# Altium schematic sheet currentmode_buck.SCHDOC: Current Mode DC-DC Converter
size A4; Address1: mkissin@gmail.com; Revision: 4.0; SheetNumber: 1; SheetTotal: 1
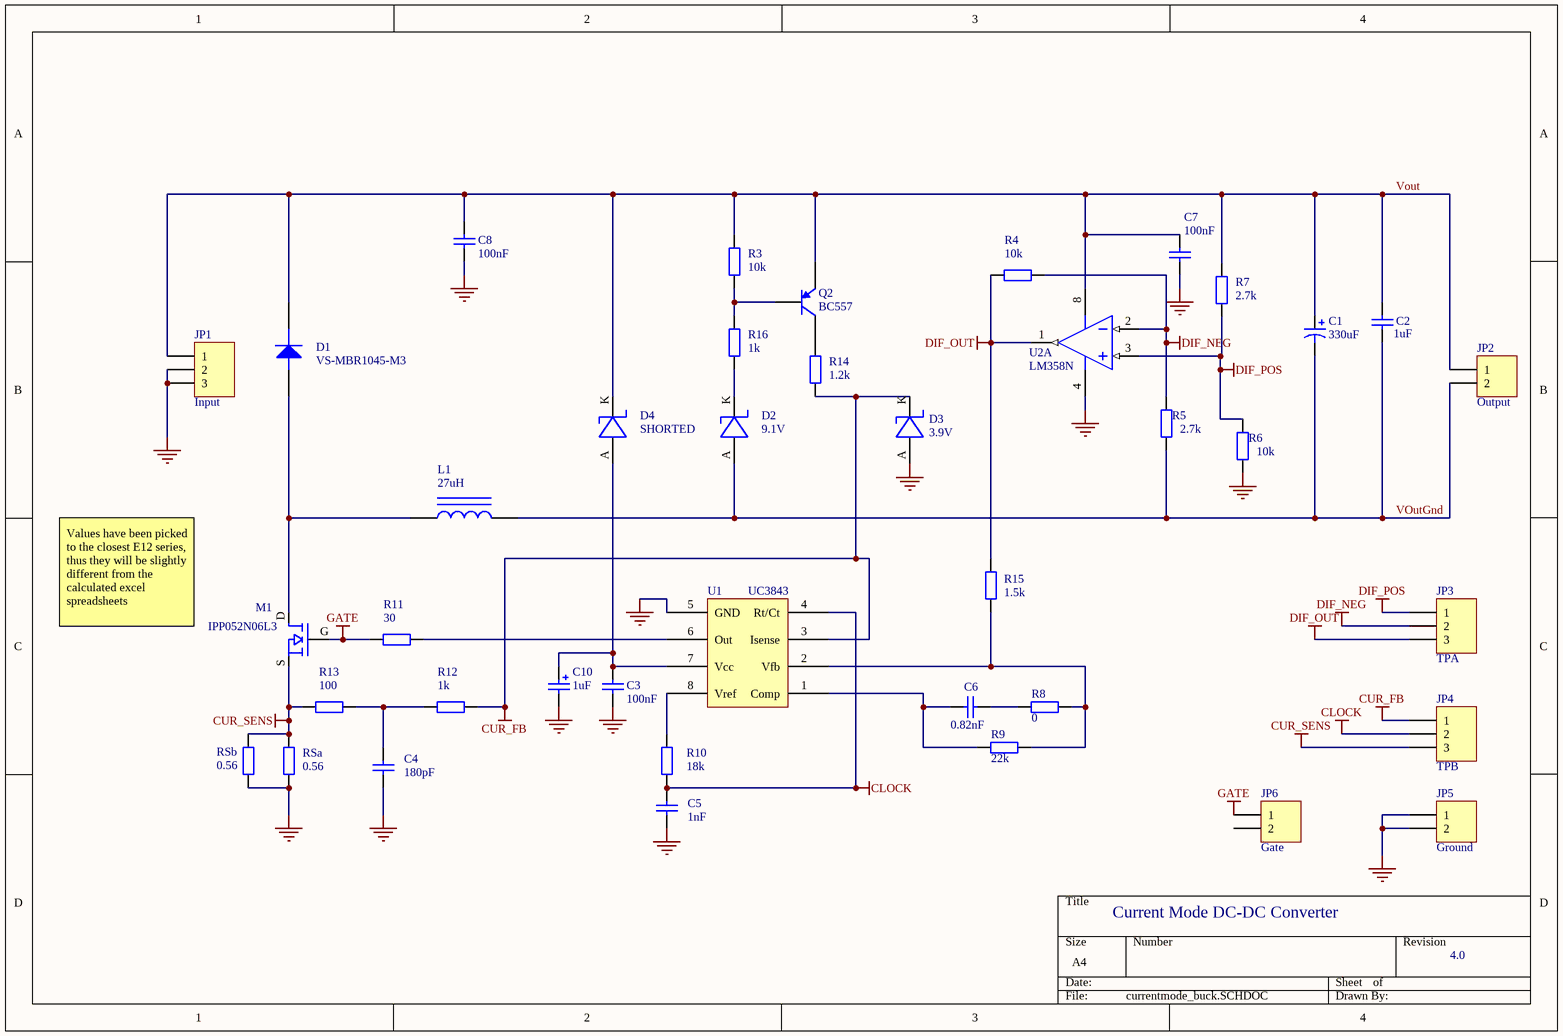
[diagram p0: currentmode_buck.SCHDOC]

## Parts
C1  value 330uF  [cappr5-5x5]  (hidden comment: Cap Pol2)
C2  value 1uF  [CAPR5.08-7.8X3.2]  (hidden comment: 120pF)
C3  value 100nF  [CAPR5.08-7.8X3.2]  (hidden comment: Cap)
C4  value 180pF  [CAPR5.08-7.8X3.2]  (hidden comment: Cap)
C5  value 1nF  [CAPR5.08-7.8X3.2]  (hidden comment: Cap)
C6  value 0.82nF  [CAPR5.08-7.8X3.2]  (hidden comment: Cap)
C7  value 100nF  [CAPR5.08-7.8X3.2]  (hidden comment: Cap)
C8  value 100nF  [CAPR5.08-7.8X3.2]  (hidden comment: Cap)
C10  value 1uF  [CAPPR1.5-4X5]  (hidden comment: Cap Pol1)
D1  VS-MBR1045-M3  [TO220_DIODE_COMB]
D2  9.1V  [DIODE0.4]
D3  3.9V  [DIODE0.4]
D4  SHORTED  [DIODE0.4]
JP1  Input  [CON3_FEM]
JP2  Output  [WIDEHEADER2]
JP3  TPA  [HDR1X3]
JP4  TPB  [HDR1X3]
JP5  Ground  [HDR1X2]
JP6  Gate  [HDR1X1]
L1  value 27uH  [efd20]  (hidden comment: Inductor Iron)
M1  IPP052N06L3  [SOT_78_H]
Q2  BC557  [29-04]
R3  10k  [AXIAL-0.4]
R4  value 10k  [AXIAL-0.4]  (hidden comment: Res2)
R5  value 2.7k  [AXIAL-0.4]  (hidden comment: Res2)
R6  value 10k  [AXIAL-0.4]  (hidden comment: Res2)
R7  value 2.7k  [AXIAL-0.4]  (hidden comment: Res2)
R8  value 0  [AXIAL-0.4]  (hidden comment: Res2)
R9  value 22k  [AXIAL-0.4]  (hidden comment: Res2)
R10  value 18k  [AXIAL-0.4]  (hidden comment: Res2)
R11  value 30  [AXIAL-0.4]  (hidden comment: Res2)
R12  value 1k  [AXIAL-0.4]  (hidden comment: Res2)
R13  value 100  [AXIAL-0.4]  (hidden comment: Res2)
R14  value 1.2k  [AXIAL-0.4]  (hidden comment: Res2)
R15  value 1.5k  [AXIAL-0.4]  (hidden comment: Res2)
R16  value 1k  [AXIAL-0.4]  (hidden comment: Res2)
RSa  value 0.56  [AXIAL-0.4]  (hidden comment: Res2)
RSb  value 0.56  [AXIAL-0.4]  (hidden comment: Res2)
U1  UC3843  [dip8]
U2  LM358N  [dip8]  (part A of 2)

## Nets
CLOCK: C5.2 JP4.2 R10.1 U1.4(Rt/Ct)
CUR_FB: D3.K JP4.1 R12.2 R14.1 U1.3(Isense)
CUR_SENS: JP4.3 M1.S R13.1 RSa.2 RSb.2
DIF_NEG: JP3.2 R4.1 R5.2 U2.2(IN-)
DIF_OUT: JP3.3 R4.2 R15.1 U2.1(OUT)
DIF_POS: JP3.1 R6.2 R7.1 U2.3(IN+)
GATE: JP6.1 M1.G R11.2
GND: C3.1 C4.1 C5.1 C7.1 C8.1 C10.2 D3.A JP1.2 JP1.3 JP5.1 JP5.2 R6.1 RSa.1 RSb.1 U1.5(GND) U2.4(V-)
Vout: C1.1 C2.2 C7.2 C8.2 D1.K D4.K JP1.1 JP2.1 Q2.3(E) R3.2 R7.2 U2.8(V+)
VOutGnd: C1.2 C2.1 D2.A JP2.2 L1.2 R5.1
NetC3_2: C3.2 C10.1 D4.A U1.7(Vcc)
NetC4_2: C4.2 R12.1 R13.2
NetC6_1: C6.1 R8.2
NetC6_2: C6.2 R9.2 U1.1(Comp)
NetD1_A: D1.A L1.4 M1.D
NetD2_K: D2.K R16.1
NetQ2_1: Q2.1(C) R14.2
NetQ2_2: Q2.2(B) R3.1 R16.2
NetR8_1: R8.1 R9.1 R15.2 U1.2(Vfb)
NetR10_2: R10.2 U1.8(Vref)
NetR11_1: R11.1 U1.6(Out)

Not connected (* = marked no-connect by the designer): JP6 2

## Notes on the sheet
- Values have been picked to the closest E12 series, thus they will be slightly different from the calculated excel spreadsheets

## Library data of the parts
C1 = Cap Pol2: Polarized Capacitor (Axial); Published: 8-Jun-2000; Revision: July-2002: Re-released for DXP Platform.; Publisher: Altium Limited
C2-C8 = Cap: Capacitor; Published: 8-Jun-2000; Revision: July-2002: Re-released for DXP Platform.; Publisher: Altium Limited
C10 = Cap Pol1: Polarized Capacitor (Radial); Published: 8-Jun-2000; Revision: July-2002: Re-released for DXP Platform.; Publisher: Altium Limited
D1 = DIODE
D2-D4 = ZENER: Zener diode
JP1 JP3 JP4 = Header 3: Header, 3-Pin; Revision: 17-Jul-2002: Re-released for DXP Platform.; Publisher: Altium Limited
JP2 JP5 JP6 = Header 2: Header, 2-Pin; Revision: 17-Jul-2002: Re-released for DXP Platform.; Publisher: Altium Limited
L1 = Inductor Iron: Magnetic-Core Inductor; Published: 24-Mar-1999; Revision: July-2002: Re-released for DXP Platform.; Publisher: Altium Limited
M1 = BUK7560: N-Channel MOSFET
Q2 = BC558B: Amplifier Transistor PNP Silicon; Package Information: Latest Revision: 1996; Published: 29-Sep-2000; Revision: 17-Jul-2002: Re-released for DXP Platform.; Datasheet: Small Signal Transistors, FETs and Diodes, DL126 Rev3 (1991); Package Reference: 29-04; Publisher: Altium Limited
R3-R16 RSa RSb = Res2: Resistor; Published: 8-Jun-2000; Revision: July-2002: Re-released for DXP Platform.; Publisher: Altium Limited
  R3: Value: 10k
U1 = SG3842: Current mode PWM Generator
U2 = LM358N: Single-Supply Dual Operational Amplifier; Package Information: Latest Revision: 1998; Published: 28-Feb-2003; Datasheet: Latest Revision: Jan-2002, Rev. 7; Package Reference: 626-05; Publisher: Altium Limited